# EAGLE board MIPS_Rev5.4 (EAGLE 9.6.2), part 1 of 2
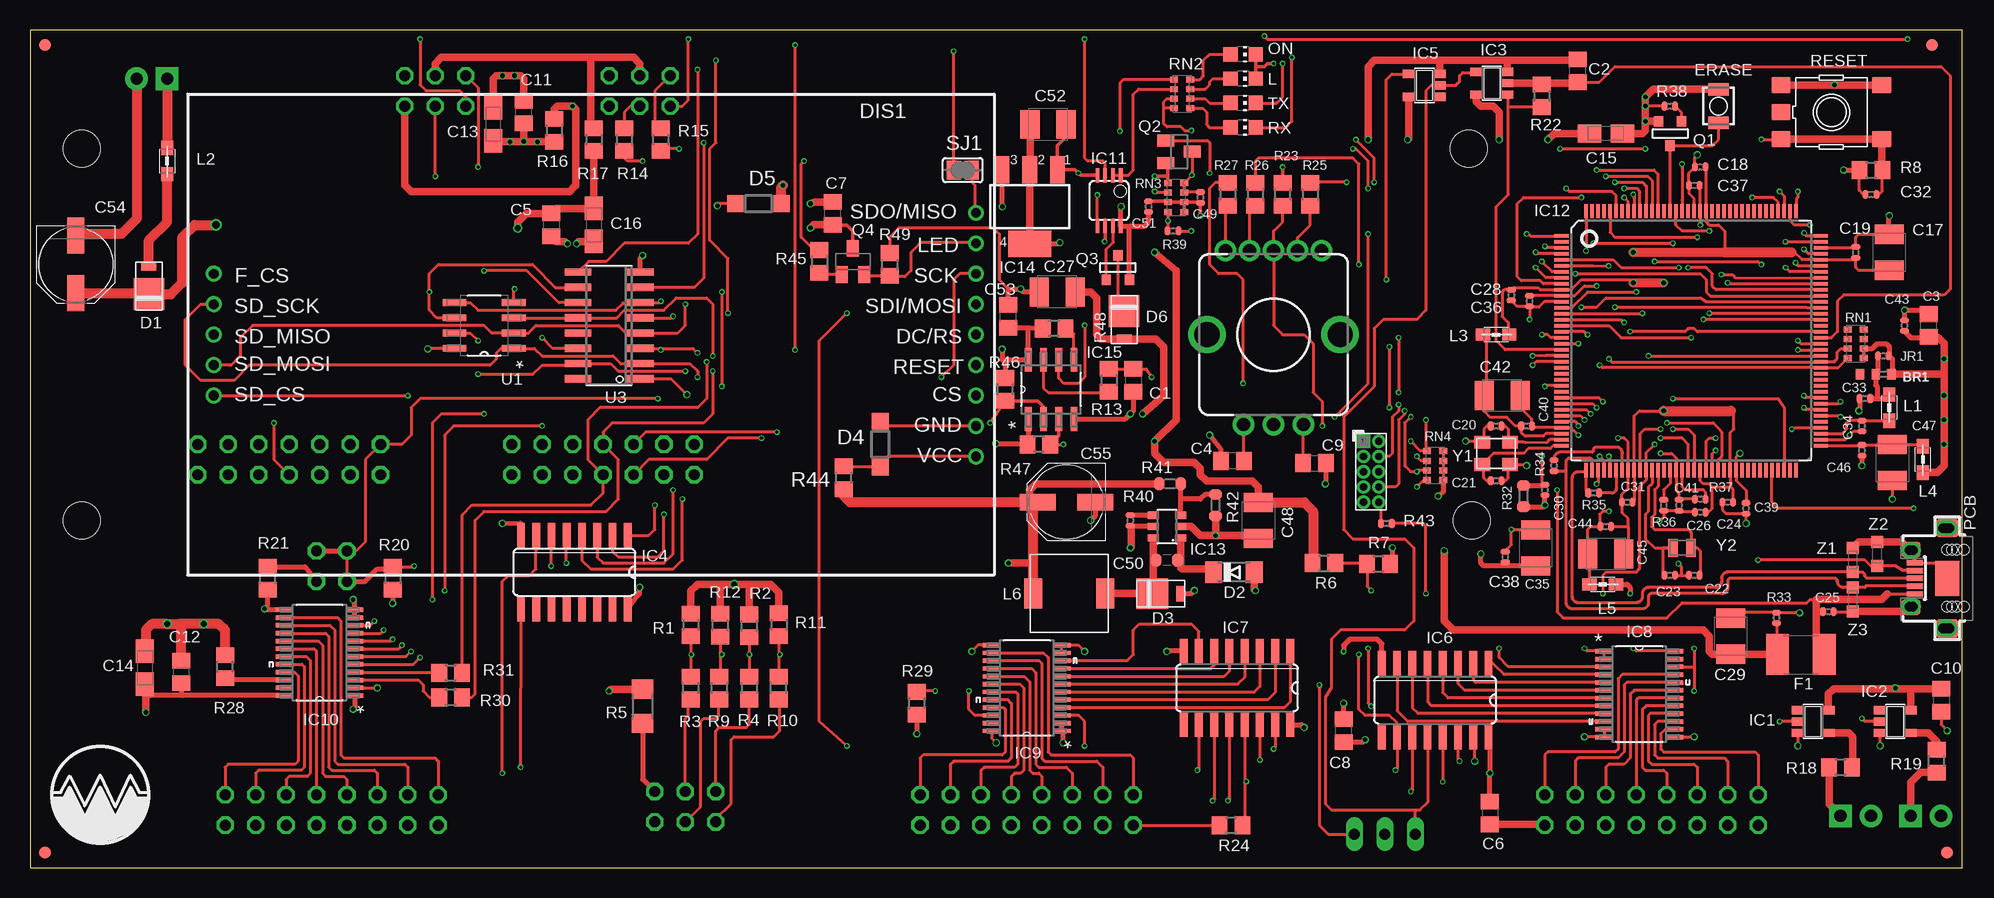
[diagram p2: board, top side]
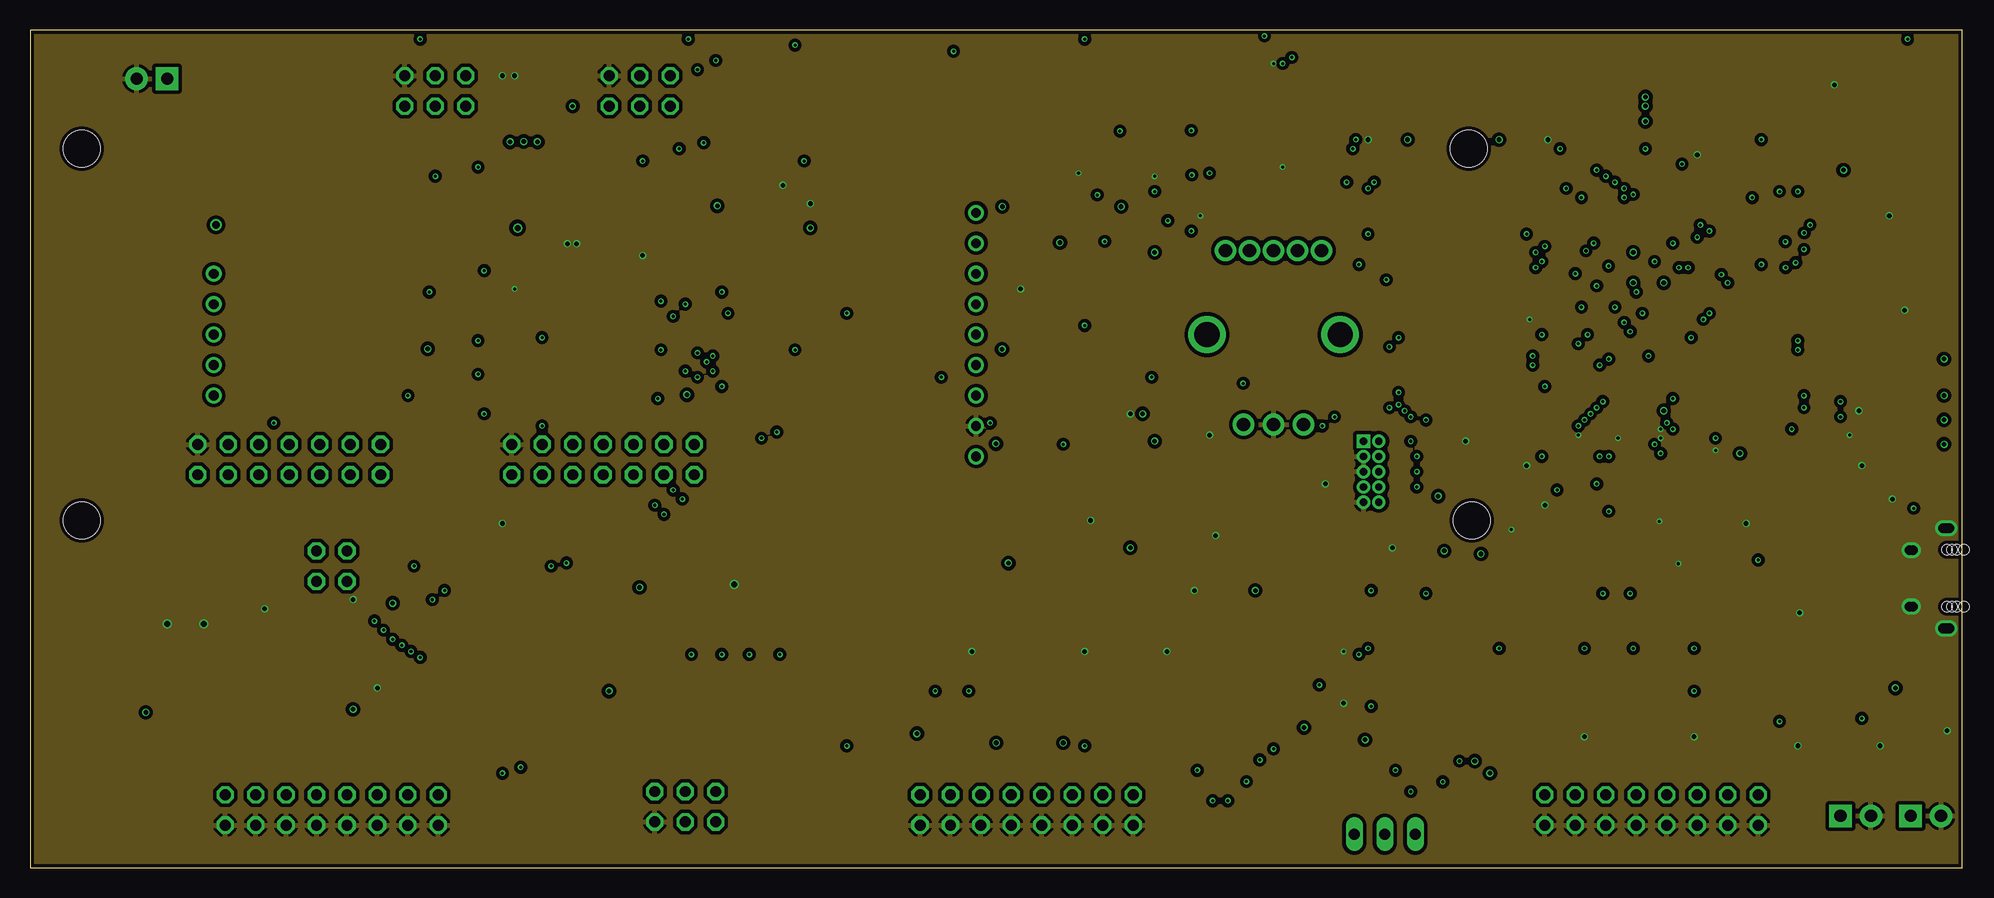
[diagram p3: board, inner layer Route2]
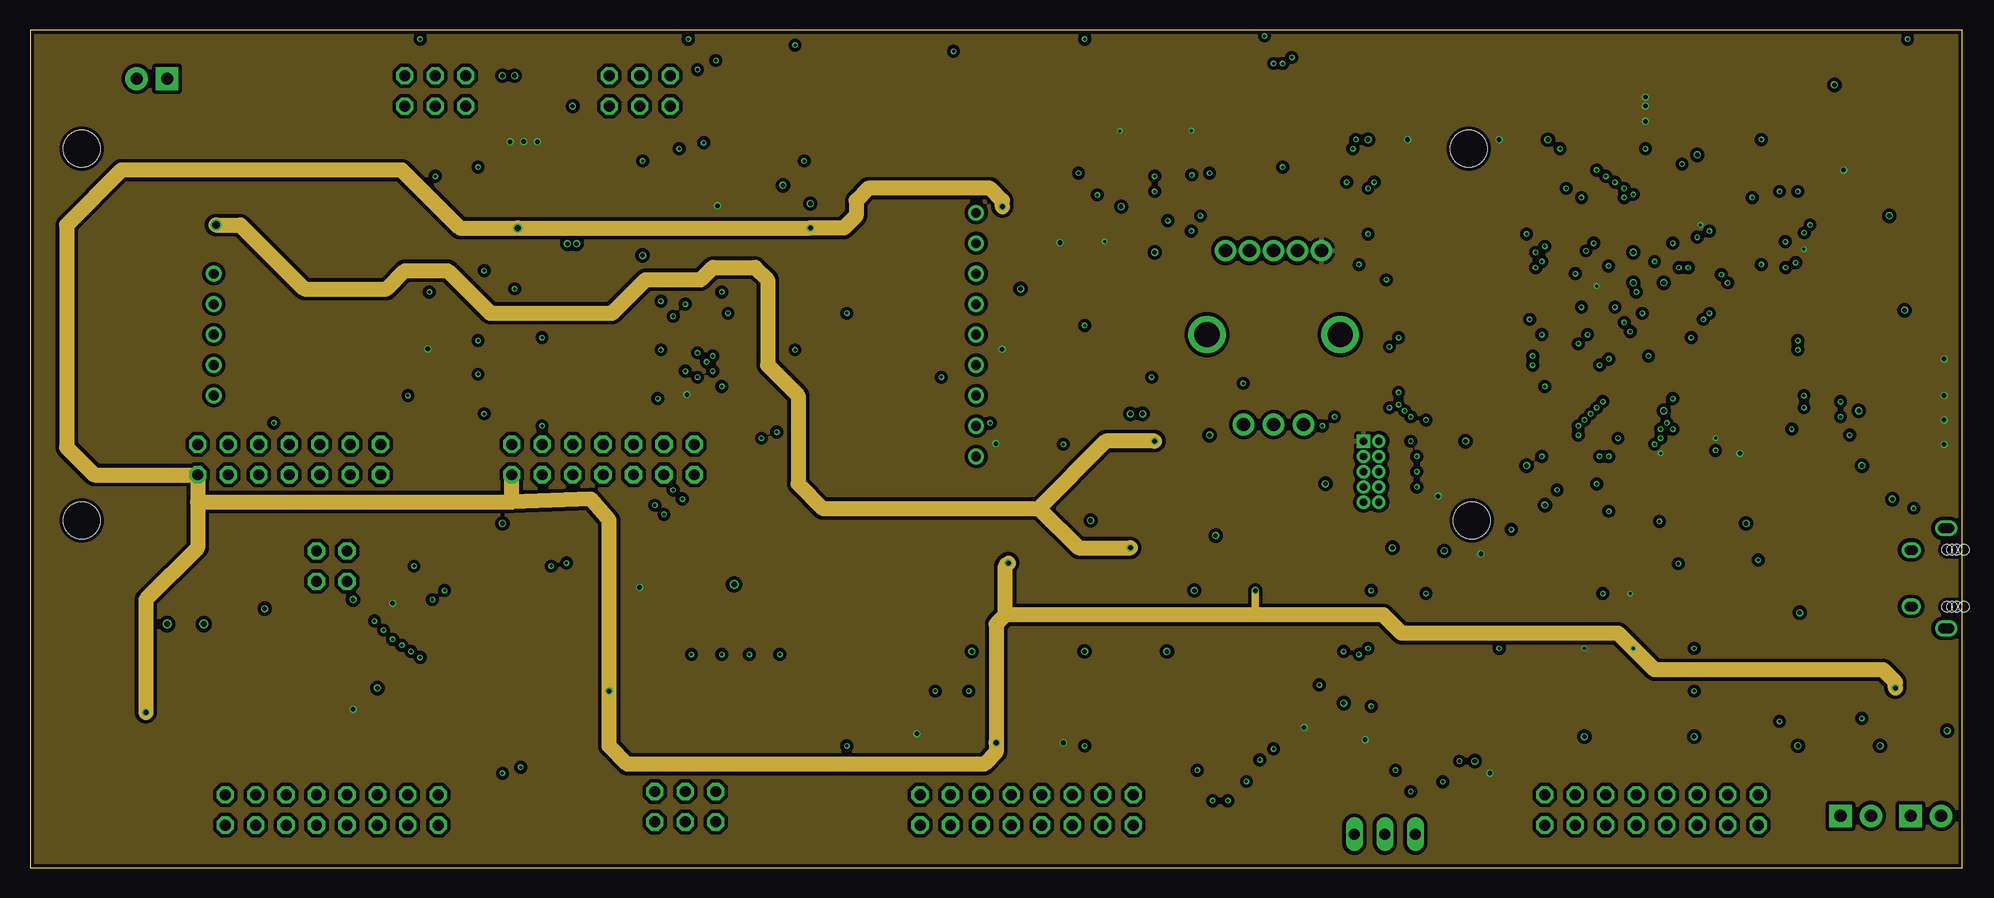
[diagram p4: board, inner layer Route15]
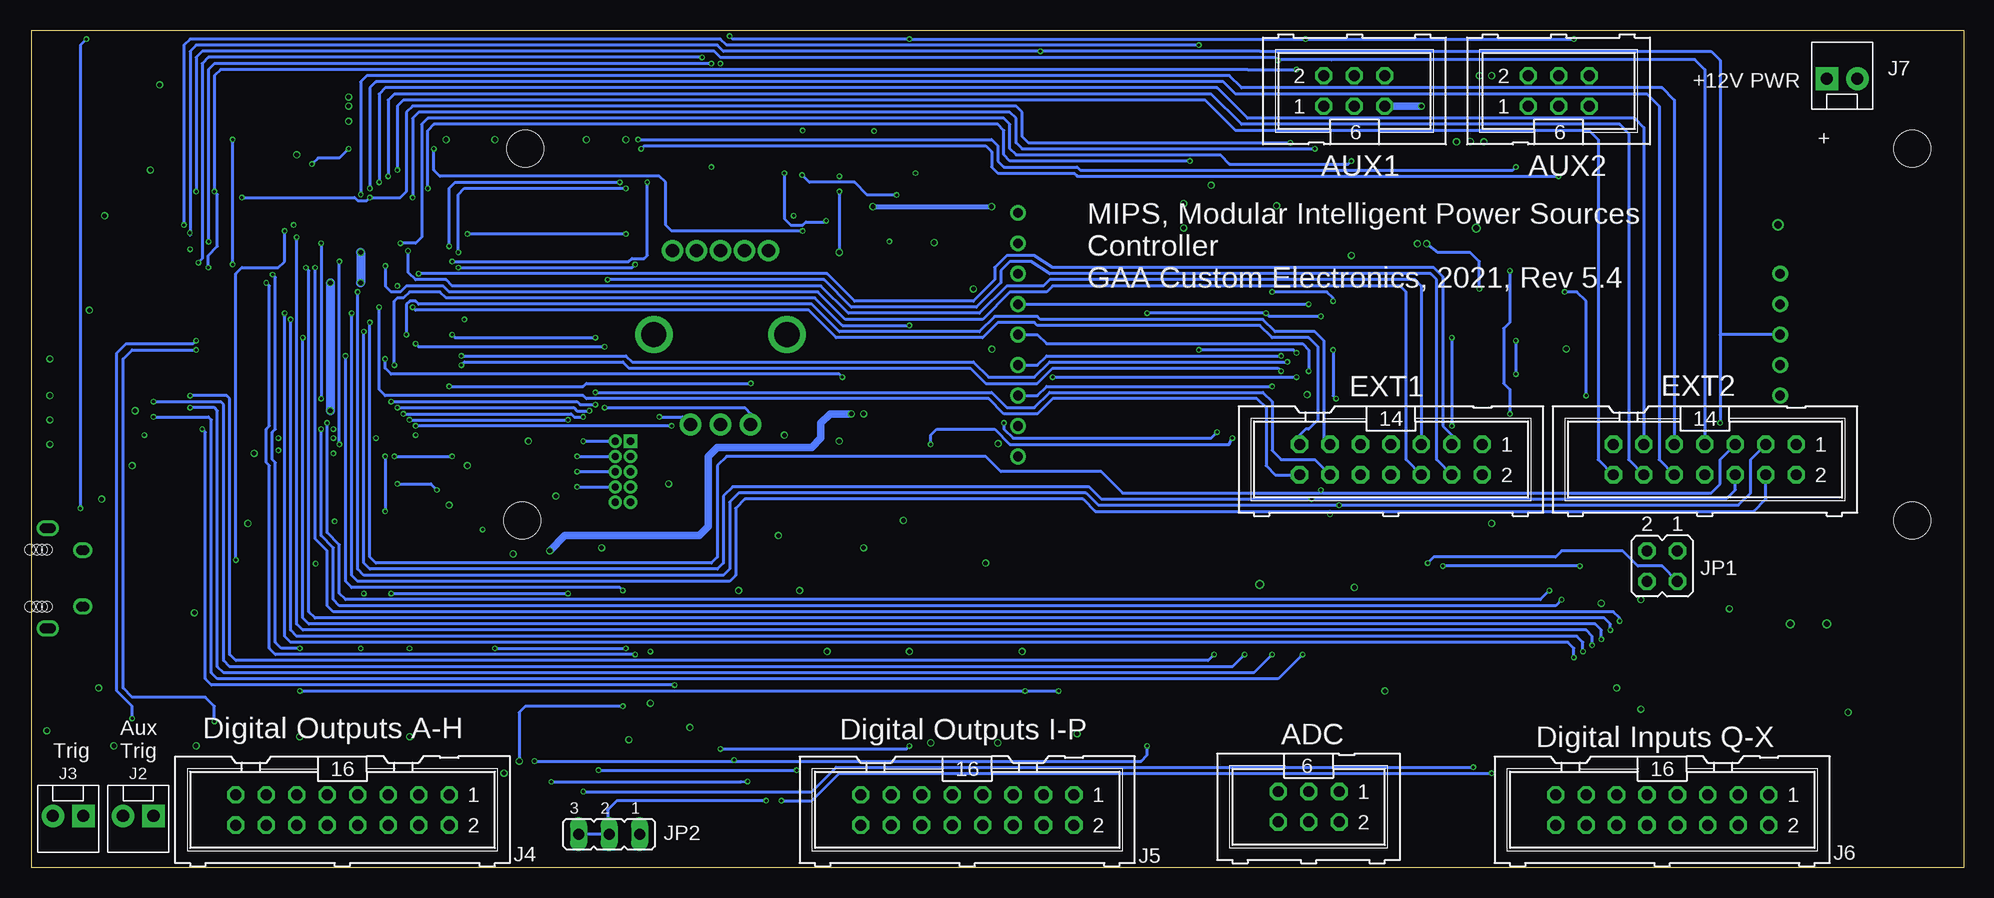
[diagram p5: board, bottom side, seen from below]

Size 161.04 x 69.85 mm. Coordinates in mm from the lower left corner, seen from the top.
Outline: 0,0 161.04,0 161.04,69.85 0,69.85 0,0
Copper layers (1*2+15*16): Top 0.035mm / dielectric 1.5mm / Route2 0.035mm / dielectric 0.15mm / Route15 0.035mm / dielectric 0.2mm / Bottom 0.035mm
Design rules "default *": minimum track width 10mil, minimum drill 10mil, track to track 6mil, track to pad 6mil, pad to pad 6mil, via to via 6mil, smd to smd 6mil, copper to edge 10mil, drill to drill 5mil, minimum pad ring 10mil, minimum via ring 4mil, stop-mask expansion 4mil, vias tented up to drill 40mil, thermal gap 10mil
Net classes: 0 default: width 0.203 mm, drill 0.254 mm, clearance 0.152 mm; 1 USB: width 0.203 mm, drill 0.254 mm, clearance 0.152 mm; 3 usbvcc: width 0.203 mm, drill 0.254 mm, clearance 0.152 mm; 4 USBpair: width 0.254 mm, drill 0.254 mm, clearance 0.152 mm
Holes 3.05 mm at 4.32,28.96 4.32,59.94 119.89,59.94 120.14,28.96

## Footprints (pad centres in the part's own frame; a part is rotated, then mirrored left to right if it is on the bottom)
ML6 = drill 0.914 octagon: 1 -2.54,-1.27; 2 -2.54,1.27; 3 0,-1.27; 4 0,1.27; 5 2.54,-1.27; 6 2.54,1.27
J0402 = smd 0.7 x 0.9: 1 -0.65,0; 2 0.65,0; 3 1.95,0
C0805 = smd 1.3 x 1.5: 1 -0.95,0; 2 0.95,0
A/3216-18R = smd 1.95 x 1.5: + 1.375,0; - -1.375,0
SMC_B = smd 1.6 x 2.4: + -1.5,0; - 1.5,0
C0402 = smd 0.508 x 0.762: 1 -0.445,0; 2 0.445,0
C0603-ROUND = smd 0.898 x 1.1: 1 -0.889,0; 2 0.889,0
PANASONIC_D = smd 3 x 1.4: + 2.4,0; - -2.4,0
DO220AAL = smd 2.667 x 2.54: P$1 -0.7,0 | smd 0.762 x 1.27: P$2 1.65,0
MINIMELF = smd 1.4 x 1.8: A 1.7,0; C -1.7,0
SOD123 = smd 1.4 x 1.4: A 1.9,0; C -1.9,0
2.2"TFT = drill 0.8: CS 32.1,-5.08; DC/RS 32.1,0; F_CS -31.42,5.08; GND 32.1,-7.62; LED 32.1,7.62; P$9VCC 32.1,-10.16; RESET 32.1,-2.54; SCK 32.1,5.08; SD_CS -31.42,-5.08; SD_MISO -31.42,0; SD_MOSI -31.42,-2.54; SD_SCK -31.42,2.54; SDI/MOSI 32.1,2.54; SDO/MISO 32.1,10.16
B3U = smd 1.016 x 1.699: 1 -1.397,0; 2 1.397,0
ML14 = drill 0.914 octagon: 1 -7.62,-1.27; 2 -7.62,1.27; 3 -5.08,-1.27; 4 -5.08,1.27; 5 -2.54,-1.27; 6 -2.54,1.27; 7 0,-1.27; 8 0,1.27; 9 2.54,-1.27; 10 2.54,1.27; 11 5.08,-1.27; 12 5.08,1.27; 13 7.62,-1.27; 14 7.62,1.27
L1812 = smd 1.9 x 3.4: 1 -1.95,0; 2 1.95,0
FIDUCIA-MOUNT = smd 1.016 x 1.016: P$1 0,0
SOT23-5 = smd 0.69 x 0.99: 1 -0.95,-1.29; 2 0,-1.29; 3 0.95,-1.29; 4 0.95,1.3; 5 -0.95,1.3
SO16 = smd 0.66 x 2.032: 1 -4.445,-3.073; 2 -3.175,-3.073; 3 -1.905,-3.073; 4 -0.635,-3.073; 5 0.635,-3.073; 6 1.905,-3.073; 7 3.175,-3.073; 8 4.445,-3.073; 9 4.445,3.073; 10 3.175,3.073; 11 1.905,3.073; 12 0.635,3.073; 13 -0.635,3.073; 14 -1.905,3.073; 15 -3.175,3.073; 16 -4.445,3.073
SOP65P640X120-24N = smd 1.473 x 0.356: 1 -2.921,3.581; 2 -2.921,2.921; 3 -2.921,2.286; 4 -2.921,1.626; 5 -2.921,0.965; 6 -2.921,0.33; 7 -2.921,-0.33; 8 -2.921,-0.965; 9 -2.921,-1.626; 10 -2.921,-2.286; 11 -2.921,-2.921; 12 -2.921,-3.581; 13 2.921,-3.581; 14 2.921,-2.921; 15 2.921,-2.286; 16 2.921,-1.626; 17 2.921,-0.965; 18 2.921,-0.33; 19 2.921,0.33; 20 2.921,0.965; 21 2.921,1.626; 22 2.921,2.286; 23 2.921,2.921; 24 2.921,3.581
MSOP08 = smd 0.3 x 1.2: 1 -0.976,-2.113; 2 -0.326,-2.113; 3 0.324,-2.113; 4 0.974,-2.113; 5 0.974,2.112; 6 0.324,2.112; 7 -0.326,2.112; 8 -0.976,2.112
LQFP144 = smd 0.3 x 1.2: 1 -8.75,-10.8; 2 -8.25,-10.8; 3 -7.75,-10.8; 4 -7.25,-10.8; 5 -6.75,-10.8; 6 -6.25,-10.8; 7 -5.75,-10.8; 8 -5.25,-10.8; 9 -4.75,-10.8; 10 -4.25,-10.8; 11 -3.75,-10.8; 12 -3.25,-10.8; 13 -2.75,-10.8; 14 -2.25,-10.8; 15 -1.75,-10.8; 16 -1.25,-10.8; 17 -0.75,-10.8; 18 -0.25,-10.8; 19 0.25,-10.8; 20 0.75,-10.8; 21 1.25,-10.8; 22 1.75,-10.8; 23 2.25,-10.8; 24 2.75,-10.8; 25 3.25,-10.8; 26 3.75,-10.8; 27 4.25,-10.8; 28 4.75,-10.8; 29 5.25,-10.8; 30 5.75,-10.8; 31 6.25,-10.8; 32 6.75,-10.8; 33 7.25,-10.8; 34 7.75,-10.8; 35 8.25,-10.8; 36 8.75,-10.8; 73 8.75,10.8; 74 8.25,10.8; 75 7.75,10.8; 76 7.25,10.8; 77 6.75,10.8; 78 6.25,10.8; 79 5.75,10.8; 80 5.25,10.8; 81 4.75,10.8; 82 4.25,10.8; 83 3.75,10.8; 84 3.25,10.8; 85 2.75,10.8; 86 2.25,10.8; 87 1.75,10.8; 88 1.25,10.8; 89 0.75,10.8; 90 0.25,10.8; 91 -0.25,10.8; 92 -0.75,10.8; 93 -1.25,10.8; 94 -1.75,10.8; 95 -2.25,10.8; 96 -2.75,10.8; 97 -3.25,10.8; 98 -3.75,10.8; 99 -4.25,10.8; 100 -4.75,10.8; 101 -5.25,10.8; 102 -5.75,10.8; 103 -6.25,10.8; 104 -6.75,10.8; 105 -7.25,10.8; 106 -7.75,10.8; 107 -8.25,10.8; 108 -8.75,10.8 | smd 1.2 x 0.3: 37 10.8,-8.75; 38 10.8,-8.25; 39 10.8,-7.75; 40 10.8,-7.25; 41 10.8,-6.75; 42 10.8,-6.25; 43 10.8,-5.75; 44 10.8,-5.25; 45 10.8,-4.75; 46 10.8,-4.25; 47 10.8,-3.75; 48 10.8,-3.25; 49 10.8,-2.75; 50 10.8,-2.25; 51 10.8,-1.75; 52 10.8,-1.25; 53 10.8,-0.75; 54 10.8,-0.25; 55 10.8,0.25; 56 10.8,0.75; 57 10.8,1.25; 58 10.8,1.75; 59 10.8,2.25; 60 10.8,2.75; 61 10.8,3.25; 62 10.8,3.75; 63 10.8,4.25; 64 10.8,4.75; 65 10.8,5.25; 66 10.8,5.75; 67 10.8,6.25; 68 10.8,6.75; 69 10.8,7.25; 70 10.8,7.75; 71 10.8,8.25; 72 10.8,8.75; 109 -10.8,8.75; 110 -10.8,8.25; 111 -10.8,7.75; 112 -10.8,7.25; 113 -10.8,6.75; 114 -10.8,6.25; 115 -10.8,5.75; 116 -10.8,5.25; 117 -10.8,4.75; 118 -10.8,4.25; 119 -10.8,3.75; 120 -10.8,3.25; 121 -10.8,2.75; 122 -10.8,2.25; 123 -10.8,1.75; 124 -10.8,1.25; 125 -10.8,0.75; 126 -10.8,0.25; 127 -10.8,-0.25; 128 -10.8,-0.75; 129 -10.8,-1.25; 130 -10.8,-1.75; 131 -10.8,-2.25; 132 -10.8,-2.75; 133 -10.8,-3.25; 134 -10.8,-3.75; 135 -10.8,-4.25; 136 -10.8,-4.75; 137 -10.8,-5.25; 138 -10.8,-5.75; 139 -10.8,-6.25; 140 -10.8,-6.75; 141 -10.8,-7.25; 142 -10.8,-7.75; 143 -10.8,-8.25; 144 -10.8,-8.75
SOT23-6 = smd 0.6 x 0.9: 1 -0.95,-1.15; 2 0,-1.15; 3 0.95,-1.15; 4 0.95,1.15; 5 0,1.15; 6 -0.95,1.15
SOT223 = smd 1.219 x 2.235: 1 -2.311,-3.099; 2 0,-3.099; 3 2.311,-3.099 | smd 3.6 x 2.2: 4 0,3.099
SOIC127P600X175-8N = smd 1.981 x 0.559: 1 -2.464,1.905; 2 -2.464,0.635; 3 -2.464,-0.635; 4 -2.464,-1.905; 5 2.464,-1.905; 6 2.464,-0.635; 7 2.464,0.635; 8 2.464,1.905
MOLEX-1X2 = drill 1.016 pad 1.88 square: 1 0,0 | drill 1.016 pad 1.88: 2 2.54,0
ML16 = drill 0.914 octagon: 1 -8.89,-1.27; 2 -8.89,1.27; 3 -6.35,-1.27; 4 -6.35,1.27; 5 -3.81,-1.27; 6 -3.81,1.27; 7 -1.27,-1.27; 8 -1.27,1.27; 9 1.27,-1.27; 10 1.27,1.27; 11 3.81,-1.27; 12 3.81,1.27; 13 6.35,-1.27; 14 6.35,1.27; 15 8.89,-1.27; 16 8.89,1.27
JP2Q = drill 0.914 octagon: 1 -1.27,-1.27; 2 -1.27,1.27; 3 1.27,-1.27; 4 1.27,1.27
JP2 = drill 0.914 long: 1 -2.54,0; 2 0,0; 3 2.54,0
R0402 = smd 0.508 x 0.762: 1 -0.445,0; 2 0.445,0
PINHEAD_2X05_127 = drill 0.6 pad 1.016 square: 1 -0.635,2.54 | drill 0.6 pad 1.016: 2 0.635,2.54; 3 -0.635,1.27; 4 0.635,1.27; 5 -0.635,0; 6 0.635,0; 7 -0.635,-1.27; 8 0.635,-1.27; 9 -0.635,-2.54; 10 0.635,-2.54
CHIP-LED0805 = smd 1.2 x 1.2: A 0,-1.05; C 0,1.05
0805 = smd 1.2 x 1: 1 -1.1,0; 2 1.1,0
SRR0604 = smd 1.5 x 2.5: P$1 3,0; P$2 -3,0
SOT-23 = smd 0.787 x 0.889: 1 0.025,-1.016; 2 -0.94,1.016; 3 0.991,1.016
SOT23 = smd 1 x 1.4: 1 -0.95,-1.1; 2 0.95,-1.1; 3 0,1.1
SOT23-BEC = smd 1 x 1.4: B -0.95,-1.1; C 0,1.1; E 0.95,-1.1
R0805 = smd 1.3 x 1.5: 1 -0.95,0; 2 0.95,0
R1206 = smd 1.6 x 1.803: 1 -1.422,0; 2 1.422,0
R0603-ROUND = smd 0.898 x 1.1: 1 -0.889,0; 2 0.889,0
TS42 = smd 1.6 x 1.4: 1 -4.2,2.25; 2 4.2,2.25; 3 -4.2,-2.25; 4 4.2,-2.25; 5 -4.2,0
CAT16 = smd 0.5 x 0.65: 1 -1.2,-0.675; 2 -0.4,-0.675; 3 0.4,-0.675; 4 1.2,-0.675; 5 1.2,0.675; 6 0.4,0.675; 7 -0.4,0.675; 8 -1.2,0.675
CAY16 = smd 0.5 x 0.65: 1 -1.2,-0.675; 2 -0.4,-0.675; 3 0.4,-0.675; 4 1.2,-0.675; 5 1.2,0.675; 6 0.4,0.675; 7 -0.4,0.675; 8 -1.2,0.675
SJ = smd 1.168 x 1.6: 1 -0.762,0; 2 0.762,0
ENCODER_LED_3 = drill 1.1 pad 1.778: 1 -4,7; 2 -2,7; 3 0,7; 4 2,7; 5 4,7 | drill 1.1 pad 1.8: A -2.5,-7.5; B 2.5,-7.5; C 0,-7.5 | drill 2.1: M1 -5.55,0; M2 5.55,0
SOIC16 = smd 0.6 x 2.2: 1 -4.445,-2.6; 2 -3.175,-2.6; 3 -1.905,-2.6; 4 -0.635,-2.6; 5 0.635,-2.6; 6 1.905,-2.6; 7 3.175,-2.6; 8 4.445,-2.6; 9 4.445,2.6; 10 3.175,2.6; 11 1.905,2.6; 12 0.635,2.6; 13 -0.635,2.6; 14 -1.905,2.6; 15 -3.175,2.6; 16 -4.445,2.6
MCR-AB1-S-RA-SMT = smd 0.4 x 1.35: 1 -1.3,2.7; 2 -0.65,2.7; 3 0,2.7; 4 0.65,2.7; 5 1.3,2.7 | drill 0.8: P$1 -4.175,0.356; P$3 -4.175,0.076; P$4 -4.175,-0.203; P$5 4.175,0.356; P$6 4.175,0.076; P$7 4.175,-0.203 | smd 2.9 x 2: P$2 0,0 | drill 0.8 pad 1.27: P$8 -2.35,3.15; P$9 -2.35,2.85; P$10 2.35,3.15; P$11 2.35,2.85 | smd 1.3 x 1.6: S1 -2.4,3; S2 2.4,3 | smd 1.5 x 1.8: S3 -4.175,0; S4 4.175,0 | hole 0.85: -2.375,0; 2.375,0; -2.375,-1.4; 2.375,-1.4; -2.375,-0.4; 2.375,-0.4; 2.375,-0.8; -2.375,-0.8
CRYSTAL-3.2-2.5 = smd 1.3 x 1.05: 1 -1.15,-0.925; 2 1.15,-0.925; 3 1.15,0.925; 4 -1.15,0.925
XTAL_CM8V-T1A-32.768KHZ-9PF-20PPM-TA-QC = smd 0.8 x 1.5: 1 -0.75,0; 2 0.75,0
CT/CN0603 = smd 1 x 1: 1 -1,0; 2 1,0

## Placement (x,y rotation side)
ADC  [ML6]  54.61,5.08 180 bottom
AUX1  [ML6]  50.8,64.77 0 bottom
AUX2  [ML6]  33.78,64.77 0 bottom
BR1  NM  [J0402]  153.16,41.15 0 top
C1  10pF  [C0805]  91.95,40.64 270 top
C2  1000pF  [C0805]  128.98,66.45 90 top
C3  [C0805]  158.24,45.21 90 top
C4  0.01uF  [C0805]  100.2,33.91 180 top
C5  [C0805]  43.43,53.59 270 top
C6  [C0805]  121.67,4.57 270 top
C7  [C0805]  66.9,54.56 90 top
C8  [C0805]  109.47,11.43 90 top
C9  0.01uF  [C0805]  107.04,33.73 0 top
C10  [C0805]  159.26,13.97 270 top
C11  [C0805]  41.15,62.99 90 top
C12  [C0805]  12.62,16.33 90 top
C13  [A/3216-18R]  38.61,61.98 270 top
C14  [A/3216-18R]  9.58,16.69 270 top
C15  [A/3216-18R]  131.32,61.21 0 top
C16  [A/3216-18R]  46.99,53.59 90 top
C17  10u  [SMC_B]  154.94,51.31 90 top
C18  100n  [C0402]  139.19,58.42 0 top
C19  100n  [C0402]  152.15,51.31 270 top
C20  22p  [C0402]  122.17,36.83 180 top
C21  22p  [C0402]  122.17,32.26 0 top
C22  22pF_NM  [C0402]  138.68,24.38 180 top
C23  22pF_NM  [C0402]  136.65,24.38 0 top
C24  100n  [C0402]  141.48,30.48 0 top
C25  10n  [C0402]  149.86,21.34 0 top
C26  100n  [C0402]  139.19,29.64 0 top
C27  10u  [SMC_B]  85.6,48.01 180 top
C28  100n  [C0402]  123.44,47.75 90 top
C29  10u  [SMC_B]  141.73,19.3 90 top
C30  22p  [C0402]  126.24,31.5 270 top
C31  100n  [C0402]  133.1,30.48 0 top
C32  10n  [C0402]  153.42,56.13 180 top
C33  100n  [C0402]  152.91,39.12 0 top
C34  100n  [C0402]  152.65,36.83 90 top
C35  10u  [SMC_B]  125.48,26.67 90 top
C36  100n  [C0402]  124.97,47.24 90 top
C37  100n  [C0402]  138.68,56.9 0 top
C38  100n  [C0402]  122.94,25.91 270 top
C39  100n  [C0402]  143,29.97 90 top
C40  100n  [C0402]  124.71,36.83 180 top
C41  100n  [C0402]  137.41,30.23 90 top
C42  10u  [SMC_B]  122.68,39.37 0 top
C43  100n  [C0402]  156.21,45.21 270 top
C44  100n  [C0402]  131.32,28.45 180 top
C45  10u  [SMC_B]  131.32,26.16 0 top
C46  100n  [C0402]  152.65,34.8 90 top
C47  10u  [SMC_B]  155.19,33.78 270 top
C48  10u  [SMC_B]  102.36,28.96 270 top
C49  100n  [C0402]  97.54,55.88 90 top
C50  10n  [C0603-ROUND]  94.74,25.65 180 top
C51  100n  [C0402]  93.22,55.12 270 top
C52  10u  [SMC_B]  84.84,61.98 0 top
C53  0.1  [C0805]  81.53,45.97 90 top
C54  47u  [PANASONIC_D]  3.81,50.29 270 top
C55  47u  [PANASONIC_D]  86.36,30.48 180 top
D1  SS1P3L  [DO220AAL]  9.91,48.51 90 top
D2  CD1206-S01575  [MINIMELF]  100.33,24.64 0 top
D3  SS1P3L  [DO220AAL]  94.23,22.86 0 top
D4  [SOD123]  70.87,35.31 90 top
D5  [SOD123]  60.71,55.37 0 top
D6  SS1P3L  [DO220AAL]  91.19,45.72 270 top
DIS1  2.2"TFT  [2.2"TFT]  46.74,44.45 0 top
ERASE  B3U  [B3U]  140.72,63.5 270 top
EXT1  [ML14]  47.75,34.04 180 bottom
EXT2  [ML14]  21.59,34.04 180 bottom
F1  MF-MSMF050-2 500mA  [L1812]  147.57,17.78 0 top
FID1  FIDUCIALMOUNT  [FIDUCIA-MOUNT]  159.77,1.27 0 top
FID2  FIDUCIALMOUNT  [FIDUCIA-MOUNT]  1.27,1.27 0 top
FID3  FIDUCIALMOUNT  [FIDUCIA-MOUNT]  1.27,68.58 0 top
FID4  FIDUCIALMOUNT  [FIDUCIA-MOUNT]  158.5,68.58 0 top
IC1  74AHC1G14DBV  [SOT23-5]  148.59,12.19 270 top
IC2  74AHC1G14DBV  [SOT23-5]  155.45,12.19 270 top
IC3  74AHC1G86DBV  [SOT23-5]  121.82,65.41 90 top
IC4  SN74HCT138DSOIC  [SO16]  45.36,24.64 180 top
IC5  74AHC1G04DBV  [SOT23-5]  116.2,65.23 90 top
IC6  74HC595D  [SO16]  117.09,13.97 180 top
IC7  74HC595D  [SO16]  100.58,14.99 180 top
IC8  SN74LVCC3245APW  [SOP65P640X120-24N]  134.11,14.48 0 top
IC9  SN74LVCC3245APW  [SOP65P640X120-24N]  83.06,14.99 180 top
IC10  SN74LVCC3245APW  [SOP65P640X120-24N]  24.13,17.93 180 top
IC11  LMV358IDGKR  [MSOP08]  89.92,55.63 180 top
IC12  ATSAM3X8EA-AU  [LQFP144]  138.43,43.94 270 top
IC13  LM2734Y  [SOT23-6]  94.74,28.45 90 top
IC14  NCP1117ST33T3G -3V3  [SOT223]  83.31,55.12 180 top
IC15  PCA9517D  [SOIC127P600X175-8N]  85.09,39.88 90 top
J2  M02POLAR  [MOLEX-1X2]  150.88,4.32 180 bottom
J3  M02POLAR  [MOLEX-1X2]  156.72,4.32 180 bottom
J4  [ML16]  135.13,4.83 180 bottom
J5  [ML16]  83.06,4.83 180 bottom
J6  [ML16]  25.15,4.83 180 bottom
J7  M02POLAR  [MOLEX-1X2]  11.43,65.79 0 bottom
JP1  [JP2Q]  25.15,25.15 180 bottom
JP2  [JP2]  112.9,2.79 180 bottom
JR1  0R  [R0402]  154.43,42.67 180 top
JTAG  [PINHEAD_2X05_127]  111.76,33.02 0 top
L  YELLOW  [CHIP-LED0805]  101.09,65.79 270 top
L1  MH2029-300Y  [0805]  154.94,38.35 270 top
L2  MH2029-300Y  [0805]  11.43,58.93 90 top
L3  MH2029-300Y  [0805]  122.17,44.45 180 top
L4  MH2029-300Y  [0805]  157.73,34.04 90 top
L5  MH2029-300Y  [0805]  131.06,23.62 180 top
L6  10u SRR0604-100ML  [SRR0604]  86.61,22.86 0 top
ON  GREEN  [CHIP-LED0805]  101.09,67.82 270 top
Q1  FDN340P  [SOT-23]  136.65,61.21 0 top
Q2  BC847BSMD  [SOT23]  95.76,59.69 270 top
Q3  FDN340P  [SOT-23]  90.68,50.04 180 top
Q4  [SOT23-BEC]  68.58,50.55 0 top
R1  10K  [R0805]  55.07,20.24 270 top
R2  10K  [R0805]  59.92,20.17 270 top
R3  10K  [R0805]  55.04,14.99 270 top
R4  10K  [R0805]  59.94,14.99 270 top
R5  10  [R1206]  51.05,13.46 90 top
R6  10k  [R0805]  107.82,25.4 0 top
R7  1000  [R0805]  112.37,25.35 0 top
R8  1K  [R0805]  153.42,58.17 0 top
R9  10K  [R0805]  57.45,14.99 90 top
R10  10K  [R0805]  62.38,14.99 90 top
R11  10K  [R0805]  62.41,20.27 270 top
R12  10K  [R0805]  57.51,20.22 270 top
R13  10  [R0805]  89.92,40.64 270 top
R14  100  [R0805]  49.53,60.71 270 top
R15  100  [R0805]  52.58,60.71 90 top
R16  10  [R0805]  43.69,61.47 270 top
R17  1  [R0805]  46.99,60.71 270 top
R18  100  [R0805]  150.88,8.38 0 top
R19  100  [R0805]  158.88,8.89 90 top
R20  1K  [R0805]  30.23,24.13 270 top
R21  1K  [R0805]  19.81,24.13 90 top
R22  1K  [R0805]  125.98,64.36 270 top
R23  1K  [R0805]  104.39,56.13 90 top
R24  100  [R0805]  100.08,3.56 0 top
R25  330  [R0805]  106.68,56.13 270 top
R26  330  [R0805]  102.11,56.13 270 top
R27  330  [R0805]  99.82,56.13 270 top
R28  1K  [R0805]  16.26,16.76 90 top
R29  1K  [R0805]  73.91,13.72 90 top
R30  100  [R0805]  35.05,14.22 0 top
R31  100  [R0805]  35.05,16.26 0 top
R32  6k8 1%  [R0603-ROUND]  124.46,30.99 90 top
R33  10K  [R0402]  145.54,20.83 270 top
R34  39R 1%  [R0402]  127,33.53 90 top
R35  39R 1%  [R0402]  130.3,31.24 0 top
R36  0R_NM  [R0402]  136.14,30.23 90 top
R37  100K  [R0402]  139.19,30.73 180 top
R38  10K  [R0402]  136.65,63.5 180 top
R39  1K  [R0402]  95.25,53.09 180 top
R40  10k  [R0402]  91.69,28.96 90 top
R41  52K3  [R0603-ROUND]  95,32 0 top
R42  10K  [R0603-ROUND]  98.81,30.23 270 top
R43  0R  [R0402]  113.03,28.7 0 top
R44  [R0805]  67.82,32.51 90 top
R45  1000  [R0805]  65.79,50.55 270 top
R46  4700  [R0805]  81.28,39.88 90 top
R47  4700  [R0805]  84.07,35.31 180 top
R48  1000  [R0805]  85.34,44.96 180 top
R49  1000  [R0805]  71.63,50.29 270 top
RESET  TS42  [TS42]  150.11,62.99 0 top
RN1  1K5  [CAT16]  152.15,43.69 90 top
RN2  1k  [CAY16]  96.01,64.52 90 top
RN3  100K  [CAT16]  95.5,55.88 90 top
RN4  100K  [CAT16]  117.09,33.53 270 top
RX  YELLOW  [CHIP-LED0805]  101.09,61.72 270 top
SJ1  [SJ]  77.72,58.17 0 top
SW1  [ENCODER_LED_3]  103.63,44.45 0 top
TX  YELLOW  [CHIP-LED0805]  101.09,63.75 270 top
U1  SP723ABG  [SOIC127P600X175-8N]  37.85,45.21 180 top
U3  74HC4050D  [SOIC16]  48.26,45.21 90 top
U$1  [LOGO2]  5.84,6.1 0 top
USB1  MICRO-USB-AB1  [MCR-AB1-S-RA-SMT]  159.77,24.13 90 top
Y1  12MHz KX-7 20pF  [CRYSTAL-3.2-2.5]  122.17,34.54 0 top
Y2  32.768Khz  [XTAL_CM8V-T1A-32.768KHZ-9PF-20PPM-TA-QC]  137.67,26.67 180 top
Z1  CG0603MLC-05E  [CT/CN0603]  151.89,25.65 90 top
Z2  CG0603MLC-05E  [CT/CN0603]  153.92,26.16 270 top
Z3  CG0603MLC-05E  [CT/CN0603]  151.89,22.35 270 top